# Altium schematic sheet LS1C300B_176A_Msystem.SchDoc
size A1
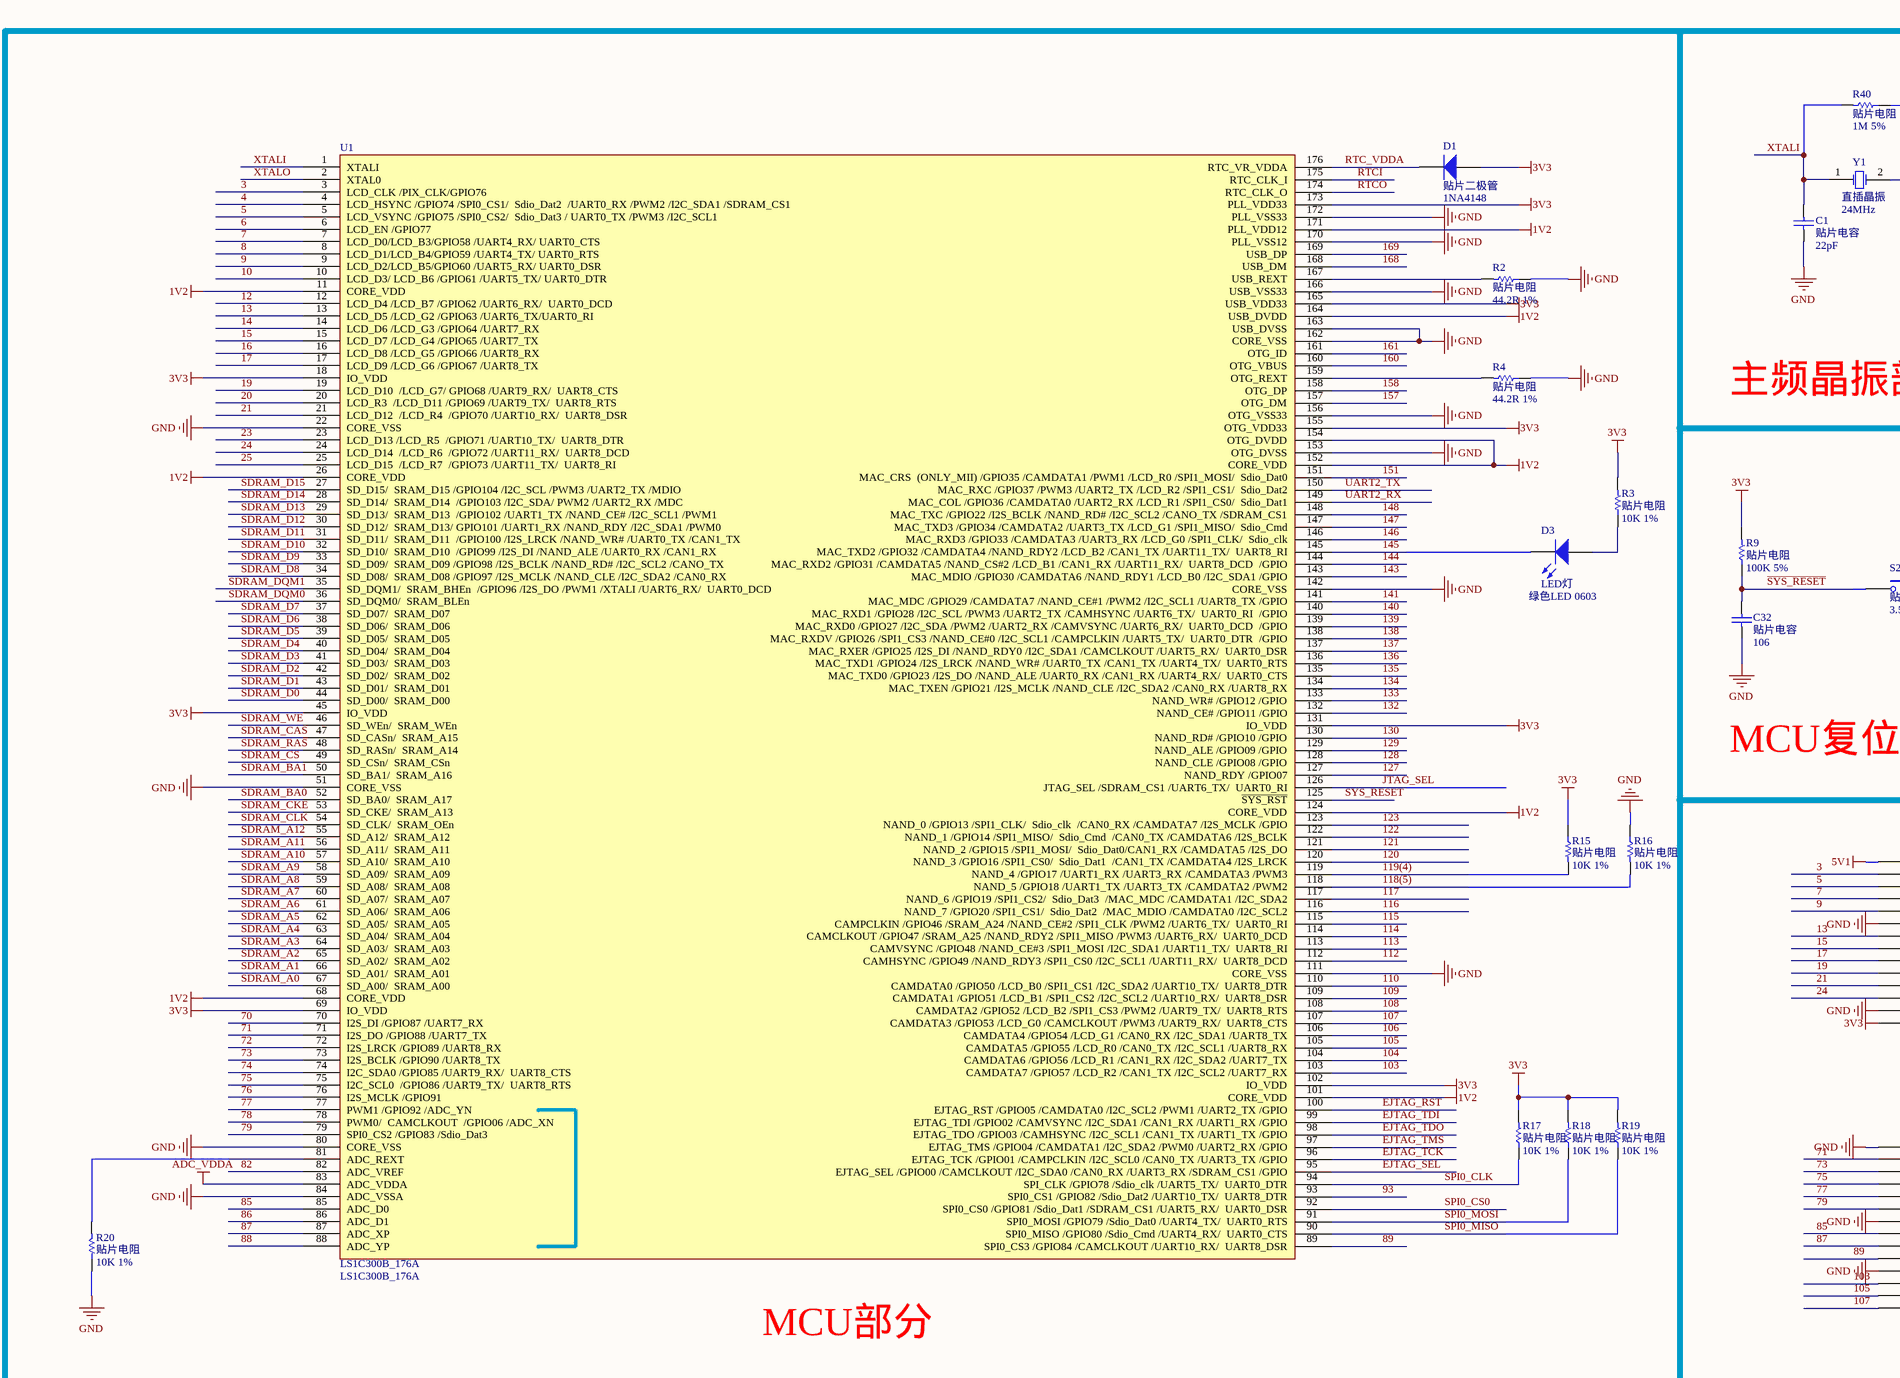
[diagram p0: LS1C300B_176A_Msystem.SchDoc, top left]
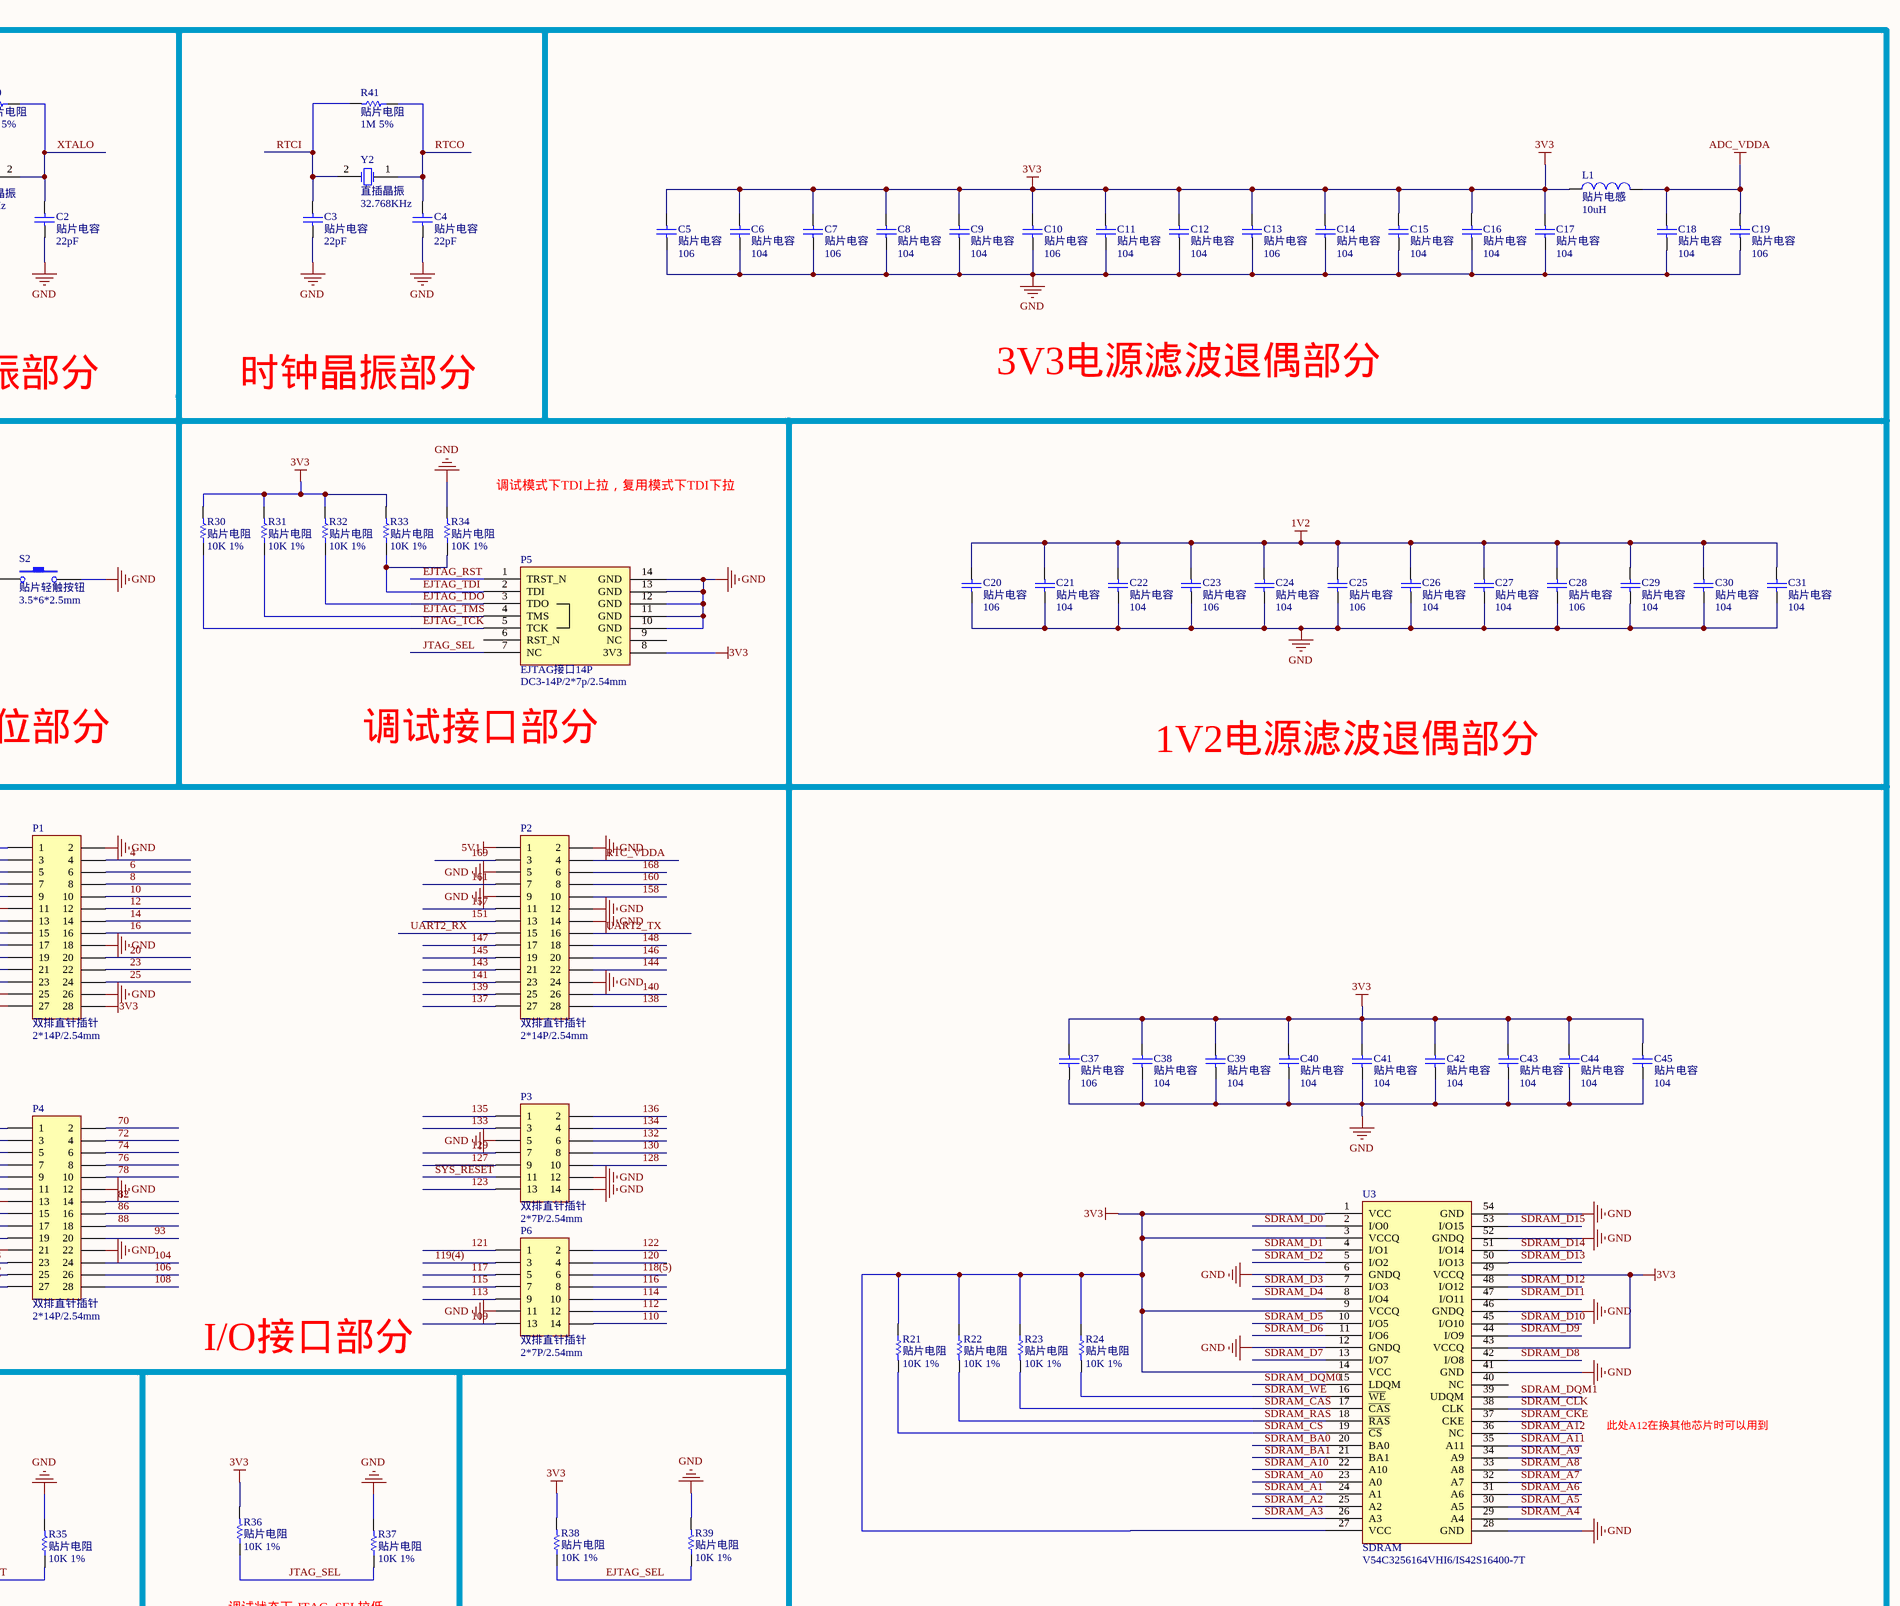
[diagram p1: LS1C300B_176A_Msystem.SchDoc, top right]
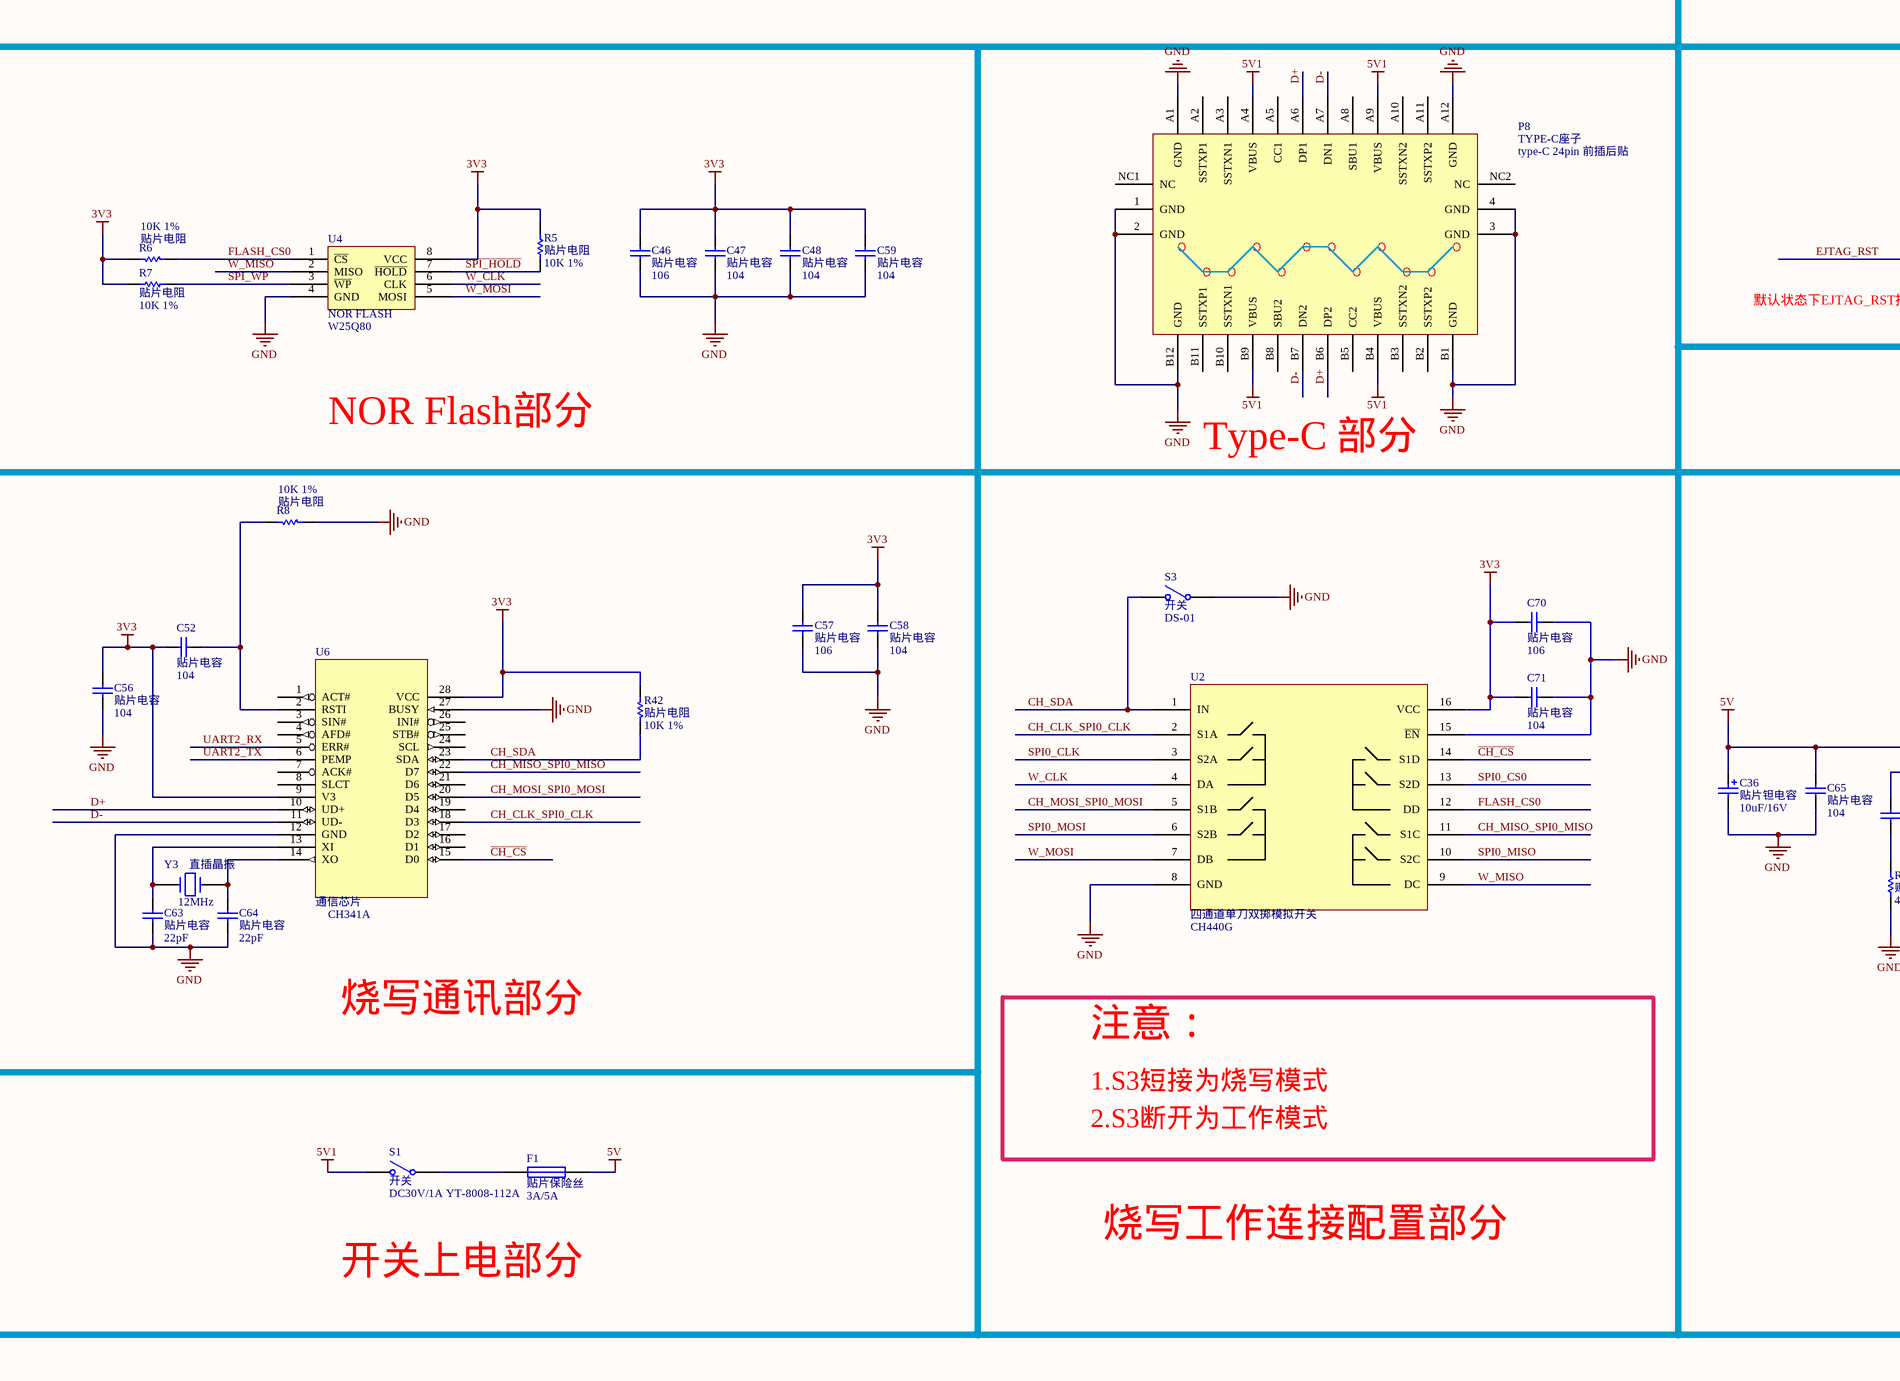
[diagram p2: LS1C300B_176A_Msystem.SchDoc, bottom left]
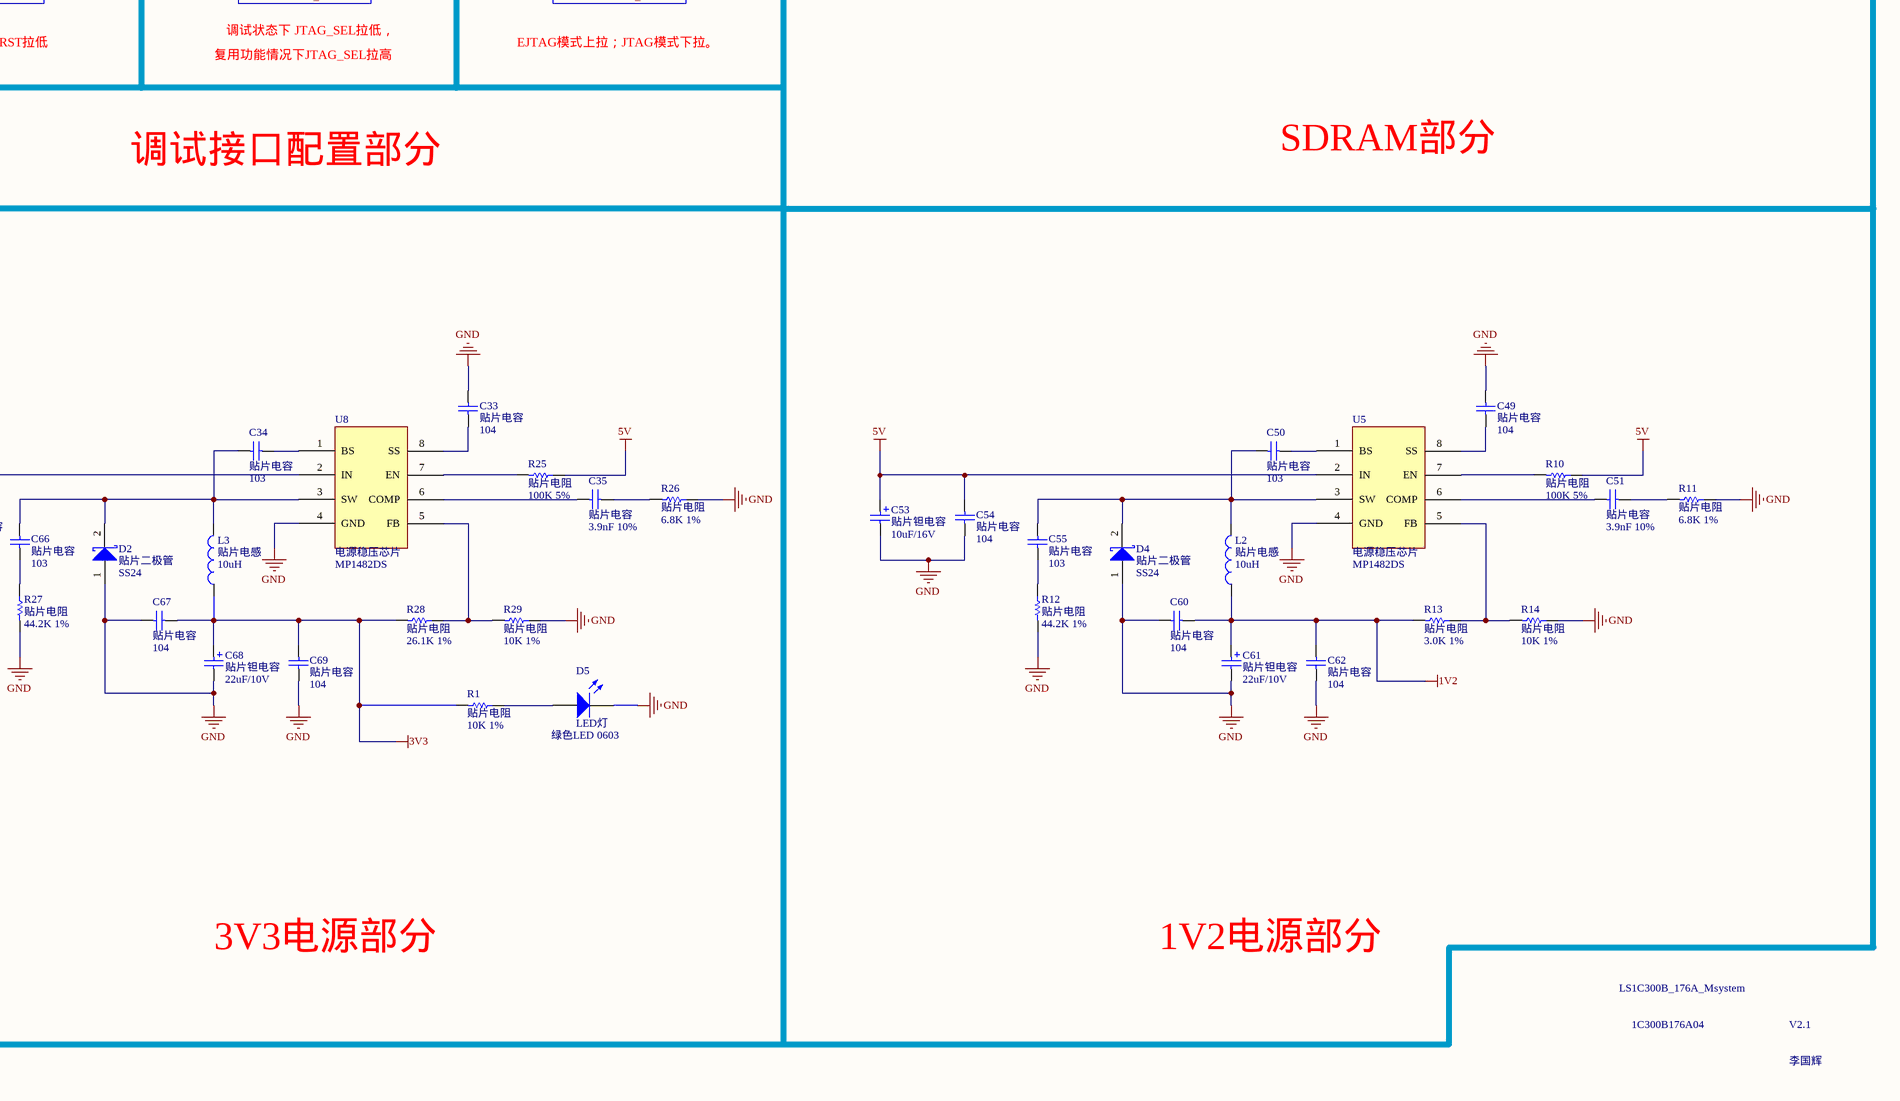
[diagram p3: LS1C300B_176A_Msystem.SchDoc, bottom right]

## Parts
C1  贴片电容  value 22pF  [C0603]
C2  贴片电容  value 22pF  [C0603]
C3  贴片电容  value 22pF  [C0603]
C4  贴片电容  value 22pF  [C0603]
C5  贴片电容  value 106  [C0603]
C6  贴片电容  value 104  [C0603]
C7  贴片电容  value 106  [C0603]
C8  贴片电容  value 104  [C0603]
C9  贴片电容  value 104  [C0603]
C10  贴片电容  value 106  [C0603]
C11  贴片电容  value 104  [C0603]
C12  贴片电容  value 104  [C0603]
C13  贴片电容  value 106  [C0603]
C14  贴片电容  value 104  [C0603]
C15  贴片电容  value 104  [C0603]
C16  贴片电容  value 104  [C0603]
C17  贴片电容  value 104  [C0603]
C18  贴片电容  value 104  [C0603]
C19  贴片电容  value 106  [C0603]
C20  贴片电容  value 106  [C0603]
C21  贴片电容  value 104  [C0603]
C22  贴片电容  value 104  [C0603]
C23  贴片电容  value 106  [C0603]
C24  贴片电容  value 104  [C0603]
C25  贴片电容  value 106  [C0603]
C26  贴片电容  value 104  [C0603]
C27  贴片电容  value 104  [C0603]
C28  贴片电容  value 106  [C0603]
C29  贴片电容  value 104  [C0603]
C30  贴片电容  value 104  [C0603]
C31  贴片电容  value 104  [C0603]
C32  贴片电容  value 106  [C0603]
C33  贴片电容  value 104  [C0603]
C34  贴片电容  value 103  [C0603]
C35  贴片电容  value 3.9nF 10%  [C0603]
C36  贴片钽电容  value 10uF/16V  [P-C1206]
C37  贴片电容  value 106  [C0603]
C38  贴片电容  value 104  [C0603]
C39  贴片电容  value 104  [C0603]
C40  贴片电容  value 104  [C0603]
C41  贴片电容  value 104  [C0603]
C42  贴片电容  value 104  [C0603]
C43  贴片电容  value 104  [C0603]
C44  贴片电容  value 104  [C0603]
C45  贴片电容  value 104  [C0603]
C46  贴片电容  value 106  [C0603]
C47  贴片电容  value 104  [C0603]
C48  贴片电容  value 104  [C0603]
C49  贴片电容  value 104  [C0603]
C50  贴片电容  value 103  [C0603]
C51  贴片电容  value 3.9nF 10%  [C0603]
C52  贴片电容  value 104  [C0603]
C53  贴片钽电容  value 10uF/16V  [P-C1206]
C54  贴片电容  value 104  [C0603]
C55  贴片电容  value 103  [C0603]
C56  贴片电容  value 104  [C0603]
C57  贴片电容  value 106  [C0603]
C58  贴片电容  value 104  [C0603]
C59  贴片电容  value 104  [C0603]
C60  贴片电容  value 104  [C0603]
C61  贴片钽电容  value 22uF/10V  [P-C1206]
C62  贴片电容  value 104  [C0603]
C63  贴片电容  value 22pF  [C0603]
C64  贴片电容  value 22pF  [C0603]
C65  贴片电容  value 104  [C0603]
C66  贴片电容  value 103  [C0603]
C67  贴片电容  value 104  [C0603]
C68  贴片钽电容  value 22uF/10V  [P-C1206]
C69  贴片电容  value 104  [C0603]
C70  贴片电容  value 106  [C0603]
C71  贴片电容  value 104  [C0603]
D1  贴片二极管  value 1NA4148  [LL-34]
D2  贴片二极管  value SS24  [DO-214AC]
D3  LED灯  value 绿色LED 0603  [LED-0603]
D4  贴片二极管  value SS24  [DO-214AC]
D5  LED灯  value 绿色LED 0603  [LED-0603]
F1  贴片保险丝  value 3A/5A  [R1206]
L1  贴片电感  value 10uH  [L0603]
L2  贴片电感  value 10uH  [CD75]
L3  贴片电感  value 10uH  [CD75]
P1  双排直针插针  value 2*14P/2.54mm  [HDR2X14]
P2  双排直针插针  value 2*14P/2.54mm  [HDR2X14]
P3  双排直针插针  value 2*7P/2.54mm  [HDR2X7]
P4  双排直针插针  value 2*14P/2.54mm  [HDR2X14]
P5  EJTAG接口14P  value DC3-14P/2*7p/2.54mm  [DC3-14P]
P6  双排直针插针  value 2*7P/2.54mm  [HDR2X7]
P8  TYPE-C座子  value type-C 24pin 前插后贴  [Type-C-24pin]
R1  贴片电阻  value 10K 1%  [R0603]
R2  贴片电阻  value 44.2R 1%  [R0603]
R3  贴片电阻  value 10K 1%  [R0603]
R4  贴片电阻  value 44.2R 1%  [R0603]
R5  贴片电阻  value 10K 1%  [R0603]
R6  贴片电阻  value 10K 1%  [R0603]
R7  贴片电阻  value 10K 1%  [R0603]
R8  贴片电阻  value 10K 1%  [R0603]
R9  贴片电阻  value 100K 5%  [R0603]
R10  贴片电阻  value 100K 5%  [R0603]
R11  贴片电阻  value 6.8K 1%  [R0603]
R12  贴片电阻  value 44.2K 1%  [R0603]
R13  贴片电阻  value 3.0K 1%  [R0603]
R14  贴片电阻  value 10K 1%  [R0603]
R15  贴片电阻  value 10K 1%  [R0603]
R16  贴片电阻  value 10K 1%  [R0603]
R17  贴片电阻  value 10K 1%  [R0603]
R18  贴片电阻  value 10K 1%  [R0603]
R19  贴片电阻  value 10K 1%  [R0603]
R20  贴片电阻  value 10K 1%  [R0603]
R21  贴片电阻  value 10K 1%  [R0603]
R22  贴片电阻  value 10K 1%  [R0603]
R23  贴片电阻  value 10K 1%  [R0603]
R24  贴片电阻  value 10K 1%  [R0603]
R25  贴片电阻  value 100K 5%  [R0603]
R26  贴片电阻  value 6.8K 1%  [R0603]
R27  贴片电阻  value 44.2K 1%  [R0603]
R28  贴片电阻  value 26.1K 1%  [R0603]
R29  贴片电阻  value 10K 1%  [R0603]
R30  贴片电阻  value 10K 1%  [R0603]
R31  贴片电阻  value 10K 1%  [R0603]
R32  贴片电阻  value 10K 1%  [R0603]
R33  贴片电阻  value 10K 1%  [R0603]
R34  贴片电阻  value 10K 1%  [R0603]
R35  贴片电阻  value 10K 1%  [R0603]
R36  贴片电阻  value 10K 1%  [R0603]
R37  贴片电阻  value 10K 1%  [R0603]
R38  贴片电阻  value 10K 1%  [R0603]
R39  贴片电阻  value 10K 1%  [R0603]
R40  贴片电阻  value 1M 5%  [R0603]
R41  贴片电阻  value 1M 5%  [R0603]
R42  贴片电阻  value 10K 1%  [R0603]
S1  开关  value DC30V/1A YT-8008-112A  [YT-8008-112A]
S2  贴片轻触按钮  value 3.5*6*2.5mm  [Touch button]
S3  开关  value DS-01  [DS-01]
U1  LS1C300B_176A  [QFP176]
U2  四通道单刀双掷模拟开关  value CH440G  [SOP-16]
U3  SDRAM  value V54C3256164VHI6/IS42S16400-7T  [TSOP54]
U4  NOR FLASH  value W25Q80  [SOIC-8-N]
U5  电源稳压芯片  value MP1482DS  [SOIC-8]
U6  通信芯片  value CH341A  [SOP28]
U8  电源稳压芯片  value MP1482DS  [SOIC-8]
Y1  直插晶振  value 24MHz  [HC-49S]
Y2  直插晶振  value 32.768KHz  [TC-38]
Y3  直插晶振  value 12MHz  [HC-49S]

## Nets
1V2: C20.2 C21.2 C22.2 C23.2 C24.2 C25.2 C26.2 C27.2 C28.2 C29.2 C30.2 C31.2 C60.1 C61.1 C62.2 L2.1 R13.2 U1.11(CORE_VDD) U1.26(CORE_VDD) U1.68(CORE_VDD) U1.101(CORE_VDD) U1.124(CORE_VDD) U1.152(CORE_VDD) U1.154(OTG_DVDD) U1.164(USB_DVDD) U1.171(PLL_VDD12)
3V3: C5.2 C6.2 C7.2 C8.2 C9.2 C10.2 C11.2 C12.2 C13.2 C14.2 C15.2 C16.2 C17.2 C37.2 C38.2 C39.2 C40.2 C41.2 C42.2 C43.2 C44.2 C45.2 C46.2 C47.2 C48.2 C52.2 C56.2 C57.2 C58.2 C59.2 C67.1 C68.1 C69.2 C70.2 C71.2 D1.1(A) L1.1 L3.1 P1.27 P1.28 P5.8(3V3) R1.2 R3.2 R5.1 R6.1 R7.1 R9.2 R15.1 R17.2 R18.2 R19.2 R21.1 R22.1 R23.1 R24.1 R28.2 R30.2 R31.2 R32.2 R33.2 R36.2 R38.2 R42.2 U1.18(IO_VDD) U1.45(IO_VDD) U1.69(IO_VDD) U1.102(IO_VDD) U1.131(IO_VDD) U1.155(OTG_VDD33) U1.165(USB_VDD33) U1.173(PLL_VDD33) U2.16(VCC) U3.1(VCC) U3.3(VCCQ) U3.9(VCCQ) U3.14(VCC) U3.27(VCC) U3.43(VCCQ) U3.49(VCCQ) U4.8(VCC) U6.9(V3) U6.28(VCC)
5V: C36.1 C53.1 C54.2 C65.2 F1.1 R10.1 R25.1 U5.2(IN) U8.2(IN)
5V1: P1.1 P2.1 P8.A4(VBUS) P8.A9(VBUS) P8.B4(VBUS) P8.B9(VBUS) S1.2(NO)
ADC_VDDA: C18.2 C19.2 L1.2 U1.83(ADC_VDDA)
GND: C1.1 C2.1 C3.1 C4.1 C5.1 C6.1 C7.1 C8.1 C9.1 C10.1 C11.1 C12.1 C13.1 C14.1 C15.1 C16.1 C17.1 C18.1 C19.1 C20.1 C21.1 C22.1 C23.1 C24.1 C25.1 C26.1 C27.1 C28.1 C29.1 C30.1 C31.1 C32.1 C33.2 C36.2 C37.1 C38.1 C39.1 C40.1 C41.1 C42.1 C43.1 C44.1 C45.1 C46.1 C47.1 C48.1 C49.2 C53.2 C54.1 C56.1 C57.1 C58.1 C59.1 C60.2 C61.2 C62.1 C63.1 C64.1 C65.1 C67.2 C68.2 C69.1 C70.1 C71.1 D2.1(A) D4.1(A) D5.2(K) P1.2 P1.11 P1.18 P1.25 P1.26 P2.2 P2.5 P2.9 P2.12 P2.14 P2.24 P3.5 P3.12 P3.14 P4.1 P4.12 P4.13 P4.21 P4.22 P5.10(GND) P5.11(GND) P5.12(GND) P5.13(GND) P5.14(GND) P6.11 P8.1(GND) P8.2(GND) P8.3(GND) P8.4(GND) P8.A1(GND) P8.A12(GND) P8.B1(GND) P8.B12(GND) R2.1 R4.1 R8.2 R11.1 R12.2 R14.1 R16.1 R20.1 R26.1 R27.2 R29.1 R34.2 R35.2 R37.2 R39.2 S2.1 S3.1(COMMON) U1.22(CORE_VSS) U1.51(CORE_VSS) U1.80(CORE_VSS) U1.84(ADC_VSSA) U1.111(CORE_VSS) U1.142(CORE_VSS) U1.153(OTG_DVSS) U1.156(OTG_VSS33) U1.162(CORE_VSS) U1.163(USB_DVSS) U1.166(USB_VSS33) U1.170(PLL_VSS12) U1.172(PLL_VSS33) U2.8(GND) U2.15(~{EN}) U3.6(GNDQ) U3.12(GNDQ) U3.28(GND) U3.41(GND) U3.46(GNDQ) U3.52(GNDQ) U3.54(GND) U4.4(GND) U5.4(GND) U6.12(GND) U6.27(BUSY) U8.4(GND)
3: P1.3 U1.3(LCD_CLK_/PIX_CLK/GPIO76)
4: P1.4 U1.4(LCD_HSYNC_/GPIO74_/SPI0_CS1/__Sdio_Dat2__/UART0_RX_/PWM2_/I2C_SDA1_/SDRAM_CS1)
5: P1.5 U1.5(LCD_VSYNC_/GPIO75_/SPI0_CS2/__Sdio_Dat3_/_UART0_TX_/PWM3_/I2C_SCL1)
6: P1.6 U1.6(LCD_EN_/GPIO77)
7: P1.7 U1.7(LCD_D0/LCD_B3/GPIO58_/UART4_RX/_UART0_CTS)
8: P1.8 U1.8(LCD_D1/LCD_B4/GPIO59_/UART4_TX/_UART0_RTS)
9: P1.9 U1.9(LCD_D2/LCD_B5/GPIO60_/UART5_RX/_UART0_DSR)
10: P1.10 U1.10(LCD_D3/_LCD_B6_/GPIO61_/UART5_TX/_UART0_DTR)
12: P1.12 U1.12(LCD_D4_/LCD_B7_/GPIO62_/UART6_RX/__UART0_DCD)
13: P1.13 U1.13(LCD_D5_/LCD_G2_/GPIO63_/UART6_TX/UART0_RI)
14: P1.14 U1.14(LCD_D6_/LCD_G3_/GPIO64_/UART7_RX)
15: P1.15 U1.15(LCD_D7_/LCD_G4_/GPIO65_/UART7_TX)
16: P1.16 U1.16(LCD_D8_/LCD_G5_/GPIO66_/UART8_RX)
17: P1.17 U1.17(LCD_D9_/LCD_G6_/GPIO67_/UART8_TX)
19: P1.19 U1.19(LCD_D10__/LCD_G7/_GPIO68_/UART9_RX/__UART8_CTS)
20: P1.20 U1.20(LCD_R3__/LCD_D11_/GPIO69_/UART9_TX/__UART8_RTS)
21: P1.21 U1.21(LCD_D12__/LCD_R4__/GPIO70_/UART10_RX/__UART8_DSR)
23: P1.22 U1.23(LCD_D13_/LCD_R5__/GPIO71_/UART10_TX/__UART8_DTR)
24: P1.23 U1.24(LCD_D14__/LCD_R6__/GPIO72_/UART11_RX/__UART8_DCD)
25: P1.24 U1.25(LCD_D15__/LCD_R7__/GPIO73_/UART11_TX/__UART8_RI)
70: P4.2 U1.70(I2S_DI_/GPIO87_/UART7_RX)
71: P4.3 U1.71(I2S_DO_/GPIO88_/UART7_TX)
72: P4.4 U1.72(I2S_LRCK_/GPIO89_/UART8_RX)
73: P4.5 U1.73(I2S_BCLK_/GPIO90_/UART8_TX)
74: P4.6 U1.74(I2C_SDA0_/GPIO85_/UART9_RX/__UART8_CTS)
75: P4.7 U1.75(I2C_SCL0__/GPIO86_/UART9_TX/__UART8_RTS)
76: P4.8 U1.76(I2S_MCLK_/GPIO91)
77: P4.9 U1.77(PWM1_/GPIO92_/ADC_YN)
78: P4.10 U1.78(PWM0/__CAMCLKOUT__/GPIO06_/ADC_XN)
79: P4.11 U1.79(SPI0_CS2_/GPIO83_/Sdio_Dat3)
82: P4.14 U1.82(ADC_VREF)
85: P4.15 U1.85(ADC_D0)
86: P4.16 U1.86(ADC_D1)
87: P4.17 U1.87(ADC_XP)
88: P4.18 U1.88(ADC_YP)
89: P4.19 U1.89(SPI0_CS3_/GPIO84_/CAMCLKOUT_/UART10_RX/__UART8_DSR)
93: P4.20 U1.93(SPI0_CS1_/GPIO82_/Sdio_Dat2_/UART10_TX/__UART8_DTR)
103: P4.23 U1.103(CAMDATA7_/GPIO57_/LCD_R2_/CAN1_TX_/I2C_SCL2_/UART7_RX)
104: P4.24 U1.104(CAMDATA6_/GPIO56_/LCD_R1_/CAN1_RX_/I2C_SDA2_/UART7_TX)
105: P4.25 U1.105(CAMDATA5_/GPIO55_/LCD_R0_/CAN0_TX_/I2C_SCL1_/UART8_RX)
106: P4.26 U1.106(CAMDATA4_/GPIO54_/LCD_G1_/CAN0_RX_/I2C_SDA1_/UART8_TX)
107: P4.27 U1.107(CAMDATA3_/GPIO53_/LCD_G0_/CAMCLKOUT_/PWM3_/UART9_RX/__UART8_CTS)
108: P4.28 U1.108(CAMDATA2_/GPIO52_/LCD_B2_/SPI1_CS3_/PWM2_/UART9_TX/__UART8_RTS)
109: P6.13 U1.109(CAMDATA1_/GPIO51_/LCD_B1_/SPI1_CS2_/I2C_SCL2_/UART10_RX/__UART8_DSR)
110: P6.14 U1.110(CAMDATA0_/GPIO50_/LCD_B0_/SPI1_CS1_/I2C_SDA2_/UART10_TX/__UART8_DTR)
112: P6.12 U1.112(CAMHSYNC_/GPIO49_/NAND_RDY3_/SPI1_CS0_/I2C_SCL1_/UART11_RX/__UART8_DCD)
113: P6.9 U1.113(CAMVSYNC_/GPIO48_/NAND_CE#3_/SPI1_MOSI_/I2C_SDA1_/UART11_TX/__UART8_RI)
114: P6.10 U1.114(CAMCLKOUT_/GPIO47_/SRAM_A25_/NAND_RDY2_/SPI1_MISO_/PWM3_/UART6_RX/__UART0_DCD)
115: P6.7 U1.115(CAMPCLKIN_/GPIO46_/SRAM_A24_/NAND_CE#2_/SPI1_CLK_/PWM2_/UART6_TX/__UART0_RI)
116: P6.8 U1.116(NAND_7_/GPIO20_/SPI1_CS1/__Sdio_Dat2__/MAC_MDIO_/CAMDATA0_/I2C_SCL2)
117: P6.5 U1.117(NAND_6_/GPIO19_/SPI1_CS2/__Sdio_Dat3__/MAC_MDC_/CAMDATA1_/I2C_SDA2)
118(5): P6.6 R16.2 U1.118(NAND_5_/GPIO18_/UART1_TX_/UART3_TX_/CAMDATA2_/PWM2)
119(4): P6.3 R15.2 U1.119(NAND_4_/GPIO17_/UART1_RX_/UART3_RX_/CAMDATA3_/PWM3)
120: P6.4 U1.120(NAND_3_/GPIO16_/SPI1_CS0/__Sdio_Dat1__/CAN1_TX_/CAMDATA4_/I2S_LRCK)
121: P6.1 U1.121(NAND_2_/GPIO15_/SPI1_MOSI/__Sdio_Dat0/CAN1_RX_/CAMDATA5_/I2S_DO)
122: P6.2 U1.122(NAND_1_/GPIO14_/SPI1_MISO/__Sdio_Cmd__/CAN0_TX_/CAMDATA6_/I2S_BCLK)
123: P3.13 U1.123(NAND_0_/GPIO13_/SPI1_CLK/__Sdio_clk__/CAN0_RX_/CAMDATA7_/I2S_MCLK_/GPIO)
127: P3.9 U1.127(NAND_RDY_/GPIO07)
128: P3.10 U1.128(NAND_CLE_/GPIO08_/GPIO)
129: P3.7 U1.129(NAND_ALE_/GPIO09_/GPIO)
130: P3.8 U1.130(NAND_RD#_/GPIO10_/GPIO)
132: P3.6 U1.132(NAND_CE#_/GPIO11_/GPIO)
133: P3.3 U1.133(NAND_WR#_/GPIO12_/GPIO)
134: P3.4 U1.134(MAC_TXEN_/GPIO21_/I2S_MCLK_/NAND_CLE_/I2C_SDA2_/CAN0_RX_/UART8_RX)
135: P3.1 U1.135(MAC_TXD0_/GPIO23_/I2S_DO_/NAND_ALE_/UART0_RX_/CAN1_RX_/UART4_RX/__UART0_CTS)
136: P3.2 U1.136(MAC_TXD1_/GPIO24_/I2S_LRCK_/NAND_WR#_/UART0_TX_/CAN1_TX_/UART4_TX/__UART0_RTS)
137: P2.27 U1.137(MAC_RXER_/GPIO25_/I2S_DI_/NAND_RDY0_/I2C_SDA1_/CAMCLKOUT_/UART5_RX/__UART0_DSR)
138: P2.28 U1.138(MAC_RXDV_/GPIO26_/SPI1_CS3_/NAND_CE#0_/I2C_SCL1_/CAMPCLKIN_/UART5_TX/__UART0_DTR__/GPIO)
139: P2.25 U1.139(MAC_RXD0_/GPIO27_/I2C_SDA_/PWM2_/UART2_RX_/CAMVSYNC_/UART6_RX/__UART0_DCD__/GPIO)
140: P2.26 U1.140(MAC_RXD1_/GPIO28_/I2C_SCL_/PWM3_/UART2_TX_/CAMHSYNC_/UART6_TX/__UART0_RI__/GPIO)
141: P2.23 U1.141(MAC_MDC_/GPIO29_/CAMDATA7_/NAND_CE#1_/PWM2_/I2C_SCL1_/UART8_TX_/GPIO)
143: P2.21 U1.143(MAC_MDIO_/GPIO30_/CAMDATA6_/NAND_RDY1_/LCD_B0_/I2C_SDA1_/GPIO)
144: P2.22 U1.144(MAC_RXD2_/GPIO31_/CAMDATA5_/NAND_CS#2_/LCD_B1_/CAN1_RX_/UART11_RX/__UART8_DCD__/GPIO)
145: D3.2(K) P2.19 U1.145(MAC_TXD2_/GPIO32_/CAMDATA4_/NAND_RDY2_/LCD_B2_/CAN1_TX_/UART11_TX/__UART8_RI)
146: P2.20 U1.146(MAC_RXD3_/GPIO33_/CAMDATA3_/UART3_RX_/LCD_G0_/SPI1_CLK/__Sdio_clk)
147: P2.17 U1.147(MAC_TXD3_/GPIO34_/CAMDATA2_/UART3_TX_/LCD_G1_/SPI1_MISO/__Sdio_Cmd)
148: P2.18 U1.148(MAC_TXC_/GPIO22_/I2S_BCLK_/NAND_RD#_/I2C_SCL2_/CANO_TX_/SDRAM_CS1)
151: P2.13 U1.151(MAC_CRS__(ONLY_MII)_/GPIO35_/CAMDATA1_/PWM1_/LCD_R0_/SPI1_MOSI/__Sdio_Dat0)
157: P2.11 U1.157(OTG_DM)
158: P2.10 U1.158(OTG_DP)
160: P2.8 U1.160(OTG_VBUS)
161: P2.7 U1.161(OTG_ID)
168: P2.6 U1.168(USB_DM)
169: P2.3 U1.169(USB_DP)
~{CH_CS}: U2.14(S1D) U6.15(D0)
CH_CLK_SPI0_CLK: U2.2(S1A) U6.18(D3)
CH_MISO_SPI0_MISO: U2.11(S1C) U6.22(D7)
CH_MOSI_SPI0_MOSI: U2.5(S1B) U6.20(D5)
CH_SDA: R42.1 S3.2(NO) U2.1(IN) U6.23(SDA)
D+: P8.A6(DP1) P8.B6(DP2) U6.10(UD+)
D-: P8.A7(DN1) P8.B7(DN2) U6.11(UD-)
EJTAG_RST: P5.1(TRST_N) R35.1 U1.100(EJTAG_RST_/GPIO05_/CAMDATA0_/I2C_SCL2_/PWM1_/UART2_TX_/GPIO)
EJTAG_SEL: R38.1 R39.1 U1.95(EJTAG_SEL_/GPIO00_/CAMCLKOUT_/I2C_SDA0_/CAN0_RX_/UART3_RX_/SDRAM_CS1_/GPIO)
EJTAG_TCK: P5.5(TCK) R30.1 U1.96(EJTAG_TCK_/GPIO01_/CAMPCLKIN_/I2C_SCL0_/CAN0_TX_/UART3_TX_/GPIO)
EJTAG_TDI: P5.2(TDI) R33.1 R34.1 U1.99(EJTAG_TDI_/GPIO02_/CAMVSYNC_/I2C_SDA1_/CAN1_RX_/UART1_RX_/GPIO)
EJTAG_TDO: P5.3(TDO) R32.1 U1.98(EJTAG_TDO_/GPIO03_/CAMHSYNC_/I2C_SCL1_/CAN1_TX_/UART1_TX_/GPIO)
EJTAG_TMS: P5.4(TMS) R31.1 U1.97(EJTAG_TMS_/GPIO04_/CAMDATA1_/I2C_SDA2_/PWM0_/UART2_RX_/GPIO)
FLASH_CS0: R6.2 U2.12(DD) U4.1(~{CS})
JTAG_SEL: P5.7(NC) R36.1 R37.1 U1.126(JTAG_SEL_/SDRAM_CS1_/UART6_TX/__UART0_RI)
RTC_VDDA: D1.2(K) P2.4 U1.176(RTC_VR_VDDA)
RTCI: C3.2 R41.2 U1.175(RTC_CLK_I) Y2.2(OSC2)
RTCO: C4.2 R41.1 U1.174(RTC_CLK_O) Y2.1(OSC1)
~{SDRAM_CAS}: R23.2 U1.47(SD_CASn/__SRAM_A15) U3.17(~{CAS})
~{SDRAM_CS}: R21.2 U1.49(SD_CSn/__SRAM_CSn) U3.19(~{CS})
~{SDRAM_RAS}: R22.2 U1.48(SD_RASn/__SRAM_A14) U3.18(~{RAS})
~{SDRAM_WE}: R24.2 U1.46(SD_WEn/__SRAM_WEn) U3.16(~{WE})
~{SPI_HOLD}: R5.2 U4.7(~{HOLD})
~{SPI_WP}: R7.2 U4.3(~{WP})
~{SYS_RESET}: C32.2 P3.11 R9.1 S2.2 U1.125(~{SYS_RST})
SDRAM_A0: U1.67(SD_A00/__SRAM_A00) U3.23(A0)
SDRAM_A1: U1.66(SD_A01/__SRAM_A01) U3.24(A1)
SDRAM_A2: U1.65(SD_A02/__SRAM_A02) U3.25(A2)
SDRAM_A3: U1.64(SD_A03/__SRAM_A03) U3.26(A3)
SDRAM_A4: U1.63(SD_A04/__SRAM_A04) U3.29(A4)
SDRAM_A5: U1.62(SD_A05/__SRAM_A05) U3.30(A5)
SDRAM_A6: U1.61(SD_A06/__SRAM_A06) U3.31(A6)
SDRAM_A7: U1.60(SD_A07/__SRAM_A07) U3.32(A7)
SDRAM_A8: U1.59(SD_A08/__SRAM_A08) U3.33(A8)
SDRAM_A9: U1.58(SD_A09/__SRAM_A09) U3.34(A9)
SDRAM_A10: U1.57(SD_A10/__SRAM_A10) U3.22(A10)
SDRAM_A11: U1.56(SD_A11/__SRAM_A11) U3.35(A11)
SDRAM_A12: U1.55(SD_A12/__SRAM_A12) U3.36(NC)
SDRAM_BA0: U1.52(SD_BA0/__SRAM_A17) U3.20(BA0)
SDRAM_BA1: U1.50(SD_BA1/__SRAM_A16) U3.21(BA1)
SDRAM_CKE: U1.53(SD_CKE/__SRAM_A13) U3.37(CKE)
SDRAM_CLK: U1.54(SD_CLK/__SRAM_OEn) U3.38(CLK)
SDRAM_D0: U1.44(SD_D00/__SRAM_D00) U3.2(I/O0)
SDRAM_D1: U1.43(SD_D01/__SRAM_D01) U3.4(I/O1)
SDRAM_D2: U1.42(SD_D02/__SRAM_D02) U3.5(I/O2)
SDRAM_D3: U1.41(SD_D03/__SRAM_D03) U3.7(I/O3)
SDRAM_D4: U1.40(SD_D04/__SRAM_D04) U3.8(I/O4)
SDRAM_D5: U1.39(SD_D05/__SRAM_D05) U3.10(I/O5)
SDRAM_D6: U1.38(SD_D06/__SRAM_D06) U3.11(I/O6)
SDRAM_D7: U1.37(SD_D07/__SRAM_D07) U3.13(I/O7)
SDRAM_D8: U1.34(SD_D08/__SRAM_D08_/GPIO97_/I2S_MCLK_/NAND_CLE_/I2C_SDA2_/CAN0_RX) U3.42(I/O8)
SDRAM_D9: U1.33(SD_D09/__SRAM_D09_/GPIO98_/I2S_BCLK_/NAND_RD#_/I2C_SCL2_/CANO_TX) U3.44(I/O9)
SDRAM_D10: U1.32(SD_D10/__SRAM_D10__/GPIO99_/I2S_DI_/NAND_ALE_/UART0_RX_/CAN1_RX) U3.45(I/O10)
SDRAM_D11: U1.31(SD_D11/__SRAM_D11__/GPIO100_/I2S_LRCK_/NAND_WR#_/UART0_TX_/CAN1_TX) U3.47(I/O11)
SDRAM_D12: U1.30(SD_D12/__SRAM_D13/_GPIO101_/UART1_RX_/NAND_RDY_/I2C_SDA1_/PWM0) U3.48(I/O12)
SDRAM_D13: U1.29(SD_D13/__SRAM_D13__/GPIO102_/UART1_TX_/NAND_CE#_/I2C_SCL1_/PWM1) U3.50(I/O13)
SDRAM_D14: U1.28(SD_D14/__SRAM_D14__/GPIO103_/I2C_SDA/_PWM2_/UART2_RX_/MDC) U3.51(I/O14)
SDRAM_D15: U1.27(SD_D15/__SRAM_D15_/GPIO104_/I2C_SCL_/PWM3_/UART2_TX_/MDIO) U3.53(I/O15)
SDRAM_DQM0: U1.36(SD_DQM0/__SRAM_BLEn) U3.15(LDQM)
SDRAM_DQM1: U1.35(SD_DQM1/__SRAM_BHEn__/GPIO96_/I2S_DO_/PWM1_/XTALI_/UART6_RX/__UART0_DCD) U3.39(UDQM)
SPI0_CLK: R17.1 U1.94(SPI_CLK_/GPIO78_/Sdio_clk_/UART5_TX/__UART0_DTR) U2.3(S2A)
SPI0_CS0: U1.92(SPI0_CS0_/GPIO81_/Sdio_Dat1_/SDRAM_CS1_/UART5_RX/__UART0_DSR) U2.13(S2D)
SPI0_MISO: R19.1 U1.90(SPI0_MISO_/GPIO80_/Sdio_Cmd_/UART4_RX/__UART0_CTS) U2.10(S2C)
SPI0_MOSI: R18.1 U1.91(SPI0_MOSI_/GPIO79_/Sdio_Dat0_/UART4_TX/__UART0_RTS) U2.6(S2B)
UART2_RX: P2.15 U1.149(MAC_COL_/GPIO36_/CAMDATA0_/UART2_RX_/LCD_R1_/SPI1_CS0/__Sdio_Dat1) U6.5(ERR#)
UART2_TX: P2.16 U1.150(MAC_RXC_/GPIO37_/PWM3_/UART2_TX_/LCD_R2_/SPI1_CS1/__Sdio_Dat2) U6.6(PEMP)
W_CLK: U2.4(DA) U4.6(CLK)
W_MISO: U2.9(DC) U4.2(MISO)
W_MOSI: U2.7(DB) U4.5(MOSI)
XTALI: C1.2 R40.2 U1.1(XTALI) Y1.1(OSC1)
XTALO: C2.2 R40.1 U1.2(XTAL0) Y1.2(OSC2)
NetC33_1: C33.1 U8.8(SS)
NetC34_1: C34.1 U8.1(BS)
NetC34_2: C34.2 C66.2 D2.2(K) L3.2 U8.3(SW)
NetC35_1: C35.1 R26.2
NetC35_2: C35.2 U8.6(COMP)
NetC49_1: C49.1 U5.8(SS)
NetC50_1: C50.1 U5.1(BS)
NetC50_2: C50.2 C55.2 D4.2(K) L2.2 U5.3(SW)
NetC51_1: C51.1 R11.2
NetC51_2: C51.2 U5.6(COMP)
NetC52_1: C52.1 R8.1 U6.2(RSTI)
NetC55_1: C55.1 R12.1
NetC63_2: C63.2 U6.13(XI) Y3.1
NetC64_2: C64.2 U6.14(XO) Y3.2
NetC66_1: C66.1 R27.1
NetD3_1: D3.1(A) R3.1
NetD5_1: D5.1(A) R1.1
NetF1_2: F1.2 S1.1(COMMON)
NetR2_2: R2.2 U1.167(USB_REXT)
NetR4_2: R4.2 U1.159(OTG_REXT)
NetR10_2: R10.2 U5.7(EN)
NetR13_1: R13.1 R14.2 U5.5(FB)
NetR20_2: R20.2 U1.81(ADC_REXT)
NetR25_2: R25.2 U8.7(EN)
NetR28_1: R28.1 R29.2 U8.5(FB)

Not connected (* = marked no-connect by the designer): P5 6(RST_N) 9(NC); P8 A2(SSTXP1) A3(SSTXN1) A5(CC1) A8(SBU1) A10(SSTXN2) A11(SSTXP2) B2(SSTXP2) B3(SSTXN2) B5(CC2) B8(SBU2) B10(SSTXN1) B11(SSTXP1) NC1(NC) NC2(NC); U3 40(NC); U6 1(ACT#) 3(SIN#) 4(AFD#) 7(ACK#) 8(SLCT) 16(D1) 17(D2) 19(D4) 21(D6) 24(SCL) 25(STB#) 26(INI#)

## Notes on the sheet
- 主频晶振部分
- 时钟晶振部分
- 3V3电源滤波退偶部分
- 调试模式下TDI上拉，复用模式下TDI下拉
- MCU复位部分
- 调试接口部分
- 1V2电源滤波退偶部分
- MCU部分
- I/O接口部分
- 此处A12在换其他芯片时可以用到
- 调试状态下 JTAG_SEL拉低，
- 默认状态下EJTAG_RST拉低
- 复用功能情况下JTAG_SEL拉高
- EJTAG模式上拉；JTAG模式下拉。
- SDRAM部分
- NOR Flash部分
- Type-C 部分
- 调试接口配置部分
- 烧写通讯部分
- 注意：
- 1.S3短接为烧写模式
- 2.S3断开为工作模式
- 开关上电部分
- 烧写工作连接配置部分
- 3V3电源部分
- 1V2电源部分
- LS1C300B_176A_Msystem
- 1C300B176A04
- V2.1
- 李国辉

## Library data of the parts
C1-C35 C37-C52 C54-C60 C62-C67 C69-C71 = Cap: Capacitor; Published: 8-Jun-2000; LatestRevisionDate: 17-Jul-2002; LatestRevisionNote: Re-released for DXP Platform.; PackageReference: RAD-0.3; Publisher: Altium Limited; PackageDescription: Radial Cap, Thru-Hole; 2 Leads; 0.3 in Pin Spacing
C36 C53 C61 C68 = Cap Pol2: Polarized Capacitor (Axial); Published: 8-Jun-2000; LatestRevisionDate: 17-Jul-2002; LatestRevisionNote: Re-released for DXP Platform.; PackageReference: POLAR0.8; Publisher: Altium Limited; PackageDescription: Polarized Capacitor; 2 Leads
D1 = Diode: Default Diode; Published: 8-Jun-2000; LatestRevisionDate: 17-Jul-2002; LatestRevisionNote: Re-released for DXP Platform.; PackageVersion: Sep-1996; PackageReference: SMC; Publisher: Altium Limited; PackageDescription: DO-214-AB/SMC; 2 C-Bend Leads; Body 7.9 x 5.9 mm, inc. leads (LxW); Code_JEDEC: DO-214-AB
D2 D4 = 1N47xx
D3 D5 = LED0: Typical INFRARED GaAs LED; Published: 8-Jun-2000; LatestRevisionDate: 08-Jul-2005; LatestRevisionNote: Mech Layer 1 removed.; PackageReference: LED-0; Publisher: Altium Limited; PackageDescription: LED; 2 Leads
F1 = Fuse 1: Fuse; Published: 8-Jun-2000; LatestRevisionDate: 17-Jul-2002; LatestRevisionNote: Re-released for DXP Platform.; PackageReference: PIN-W2/E2.8; Publisher: Altium Limited; PackageDescription: Thru-Hole; 2 Leads
L1-L3 = Inductor: Code_IEC: 1005; Published: 8-Jun-2000; LatestRevisionDate: 29-May-2009; LatestRevisionNote: IPC-7351 Footprint Added.; PackageReference: 0402-A; Publisher: Altium Limited; PackageDescription: Chip Inductor; Code_JEITA: 0402
P1 P2 P4 = MHDR2X14: Header, 14-Pin, Dual row; LatestRevisionDate: 17-Jul-2002; LatestRevisionNote: Re-released for DXP Platform.; Publisher: Altium Limited
P3 P6 = MHDR2X7: Header, 7-Pin, Dual row; LatestRevisionDate: 17-Jul-2002; LatestRevisionNote: Re-released for DXP Platform.; Publisher: Altium Limited
P5 = EJTAG-14P
P8 = Type-C-24PIN: TYPE-C座子，24pin ，可用于大电流，四脚插板，前插后贴
R1-R42 = Res1: Resistor; Published: 8-Jun-2000; LatestRevisionDate: 17-Jul-2002; LatestRevisionNote: Re-released for DXP Platform.; PackageReference: AXIAL-0.3; Publisher: Altium Limited; PackageDescription: Axial Device, Thru-Hole; 2 Leads; 0.3 in Pin Spacing
S1 S3 = SW-SPST: Single-Pole, Single-Throw Switch; Published: 24-Mar-1999; LatestRevisionDate: 17-Jul-2002; LatestRevisionNote: Re-released for DXP Platform.; PackageReference: SPST-2; Publisher: Altium Limited; PackageDescription: Switch; 2 Leads
S2 = SW-PB: Switch; Published: 24-Mar-1999; LatestRevisionDate: 17-Jul-2002; LatestRevisionNote: Re-released for DXP Platform.; PackageReference: SPST-2; Publisher: Altium Limited; PackageDescription: Switch; 2 Leads
U1 = LS1C300B_176A: 龙芯1C300B QFP176A; Value: LS1C300B_176A
U2 = CH440: 四通道单刀双掷模拟开关 ，EN 低电平使能，IN 低电平 1#端导通，高电平2#端导通，DX是公共端
U3 = IS42S16400: ISSI 公司SDRAM ， 166, 133, 100 MHz
U4 = W25Q80: nor flash W25Q64....华邦
U5 U8 = MP1482: 电源稳压芯片MPS,2A，18V的同步整流降压转换器
U6 = CH341S_P: USB to Print Port / Parallel
Y1 Y2 = XTAL: Crystal Oscillator; Published: 8-Jun-2000; LatestRevisionDate: 17-Jul-2002; LatestRevisionNote: Re-released for DXP Platform.; PackageReference: R38; Publisher: Altium Limited; PackageDescription: Crystal, Thru-Hole; 2 Leads; Body 3.1 x 8.2 mm (Dia.xH)
Y3 = CRYSTAL